# EAGLE design v01 (EAGLE 7.2.0)
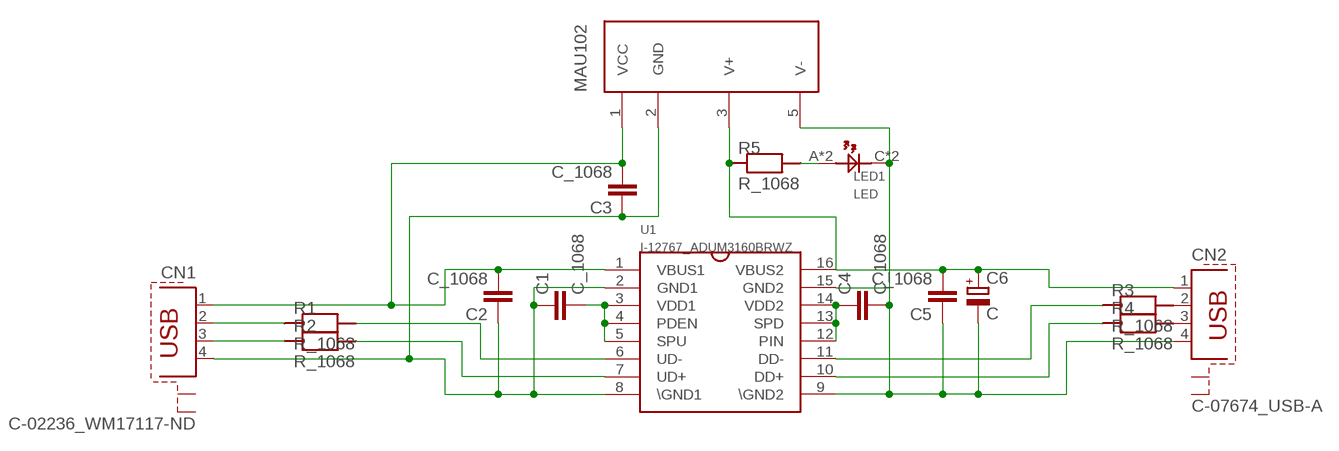
[diagram p0: schematic, sheet 1]

## Parts
C1  C_1068  [C0603]
C2  C_1068  [C0603]
C3  C_1068  [C0603]
C4  C_1068  [C0603]
C5  C_1068  [C0603]
C6  C  [153CLV-1012]
CN1  C-02236_WM17117-ND  [WM17117-ND]
CN2  C-07674_USB-A  [PN87520-S]
LED1  LED  [CHIPLED_0805]
MAU102  M-04131_MAU102  [MAU102]
R1  R_1068  [R0603]
R2  R_1068  [R0603]
R3  R_1068  [R0603]
R4  R_1068  [R0603]
R5  R_1068  [R0603]
U1  I-12767_ADUM3160BRWZ  [ADUM3160BRWZ]

## Nets
GNDA: C1.1 C1.D1 C2.1 C2.D1 C3.1 C3.D1 CN1.4 MAU102.2(GND) U1.2(GND1) U1.8(\GND1)
GNDB: C4.2 C4.D2 C5.1 C5.D1 C6.- C6.-1(-) C6.-2(-) CN2.4 LED1.C LED1.DC(C) MAU102.5(V-) U1.9(\GND2) U1.15(GND2)
N$3: C1.2 C1.D2 U1.3(VDD1) U1.4(PDEN) U1.5(SPU)
N$4: R1.2 R1.D2 U1.6(UD-)
N$5: R2.2 R2.D2 U1.7(UD+)
N$6: CN1.2 R1.1 R1.D1
N$7: CN1.3 R2.1 R2.D1
N$10: C4.1 C4.D1 U1.12(PIN) U1.13(SPD) U1.14(VDD2)
N$11: CN2.2 R3.2 R3.D2
N$12: CN2.3 R4.2 R4.D2
N$13: LED1.A LED1.DA(A) R5.2 R5.D2
N$14: R3.1 R3.D1 U1.11(DD-)
N$15: R4.1 R4.D1 U1.10(DD+)
VCCA: C2.2 C2.D2 C3.2 C3.D2 CN1.1 MAU102.1(VCC) U1.1(VBUS1)
VCCB: C5.2 C5.D2 C6.+ C6.+1(+) C6.+2(+) CN2.1 MAU102.3(V+) R5.1 R5.D1 U1.16(VBUS2)
Unconnected: CN1.P$1(S1) CN1.P$2(S2) CN1.SD1(S1) CN1.SD2(S2) CN2.S1 CN2.S2

## Library data of the parts
C1-C5 = USB-ISO:C_1068
C6 = USB-ISO:C
CN1 = USB-ISO:C-02236_WM17117-ND
CN2 = USB-ISO:C-07674_USB-A; OC_FARNELL: unknown; OC_NEWARK: unknown
LED1 = USB-ISO:LED
MAU102 = USB-ISO:M-04131_MAU102
R1-R5 = USB-ISO:R_1068
U1 = USB-ISO:I-12767_ADUM3160BRWZ

## Board
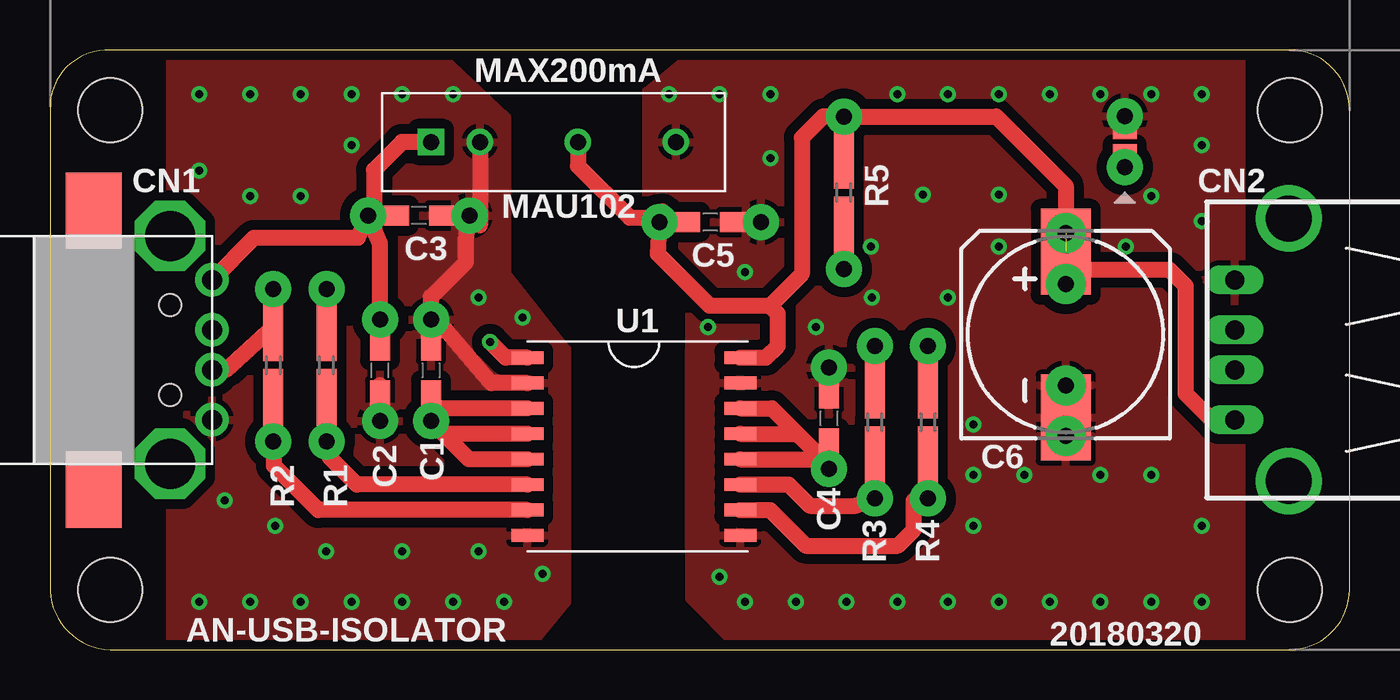
[diagram p1: board, top side]
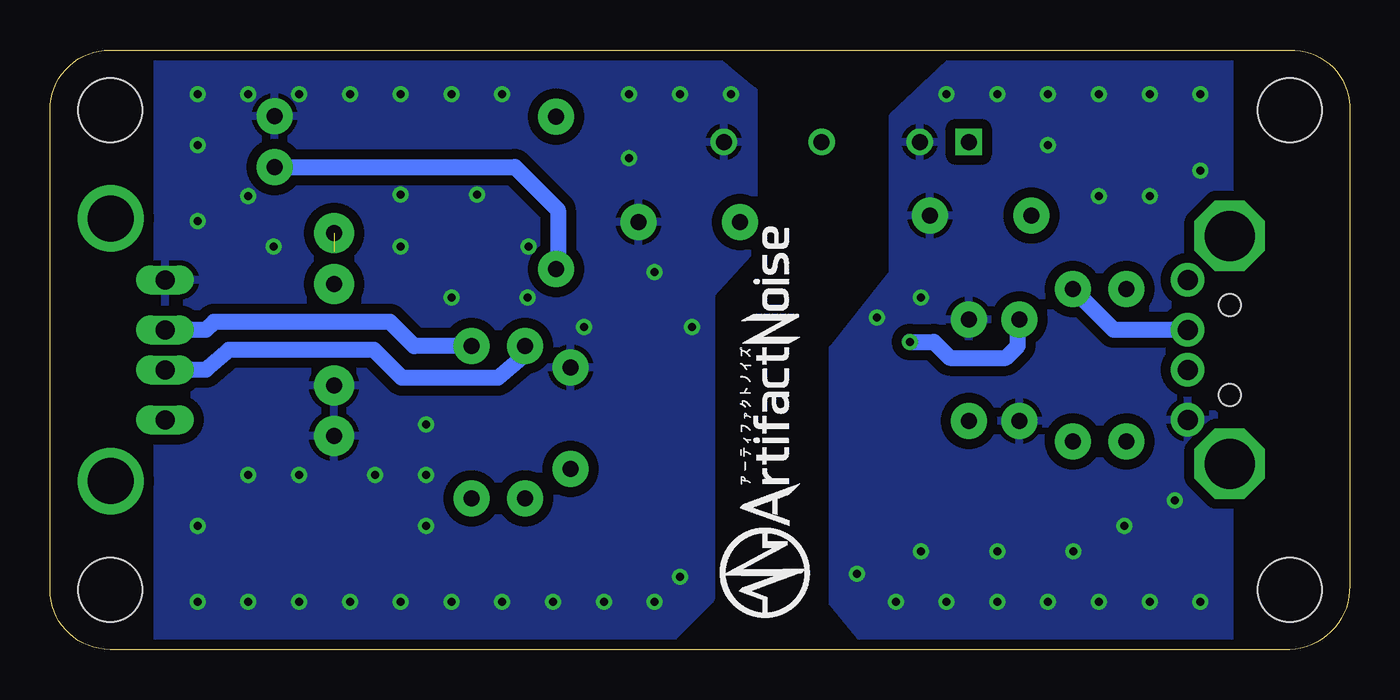
[diagram p2: board, bottom side, seen from below]

Size 65 x 30 mm. Coordinates in mm from the lower left corner, seen from the top.
Outline: 0,27.2 0,3.2 arc90 3,0 62,0 arc90 65,3 65,27 arc90 62,30 3,30 arc90 0,27.2
Copper layers (1*16): Top 0.035mm / dielectric 1.5mm / Bottom 0.035mm
Design rules "SeeedStudio_2layer_DRU_no_angle_20140221a": minimum track width 6mil, minimum drill 12mil, track to track 6mil, track to pad 6mil, pad to pad 6mil, via to via 6mil, smd to smd 0mil, copper to edge 10mil, drill to drill 10mil, minimum pad ring 10mil, minimum via ring 6mil, stop-mask expansion 2mil, vias tented up to drill 25mil, thermal gap 10mil
Holes 3.2 mm at 3,27 3,3 62,27 62,3

### Footprints (pad centres in the part's own frame; a part is rotated, then mirrored left to right if it is on the bottom)
C0603 = smd 2.6 x 1: 1 -1.8,0; 2 1.8,0 | drill 0.8 pad 1.8: D1 -2.54,0; D2 2.54,0
153CLV-1012 = smd 4.3 x 2.5: + 4.15,0; - -4.15,0 | drill 0.8 pad 2: +1 2.54,0; +2 5.08,0; -1 -5.08,0; -2 -2.54,0
WM17117-ND = drill 1 pad 1.676: 1 -3.5,2.1; 2 -1,2.1; 3 1,2.1; 4 3.5,2.1 | smd 3.81 x 2.794: P$1 -6.97,-3.81; P$2 7,-3.81 | drill 2.5 pad 3.5 octagon: SD1 -5.7,0; SD2 5.7,0 | hole 1.1: -2.25,0; 2.25,0
PN87520-S = drill 0.95 long: 1 -3.5,2.71; 2 -1,2.71; 3 1,2.71; 4 3.5,2.71 | drill 2.3 pad 2.9: S1 -6.57,0; S2 6.57,0
CHIPLED_0805 = smd 1.2 x 0.8: A 0,-1.8; C 0,-0.74 | drill 0.8 pad 1.8: DA 0,-2.54; DC 0,0
MAU102 = drill 0.8 square: 1 -7.62,0 | drill 0.8: 2 -5.17,0; 3 -0.27,0; 5 4.63,0
R0603 = smd 3.2 x 1: 1 -1.8,0; 2 1.8,0 | drill 0.8 pad 1.8: D1 -3.81,0; D2 3.81,0
ADUM3160BRWZ = smd 1.6 x 0.635: 1 -5.325,4.445; 2 -5.325,3.175; 3 -5.325,1.905; 4 -5.325,0.635; 5 -5.325,-0.635; 6 -5.325,-1.905; 7 -5.325,-3.175; 8 -5.325,-4.445; 9 5.325,-4.445; 10 5.325,-3.175; 11 5.325,-1.905; 12 5.325,-0.635; 13 5.325,0.635; 14 5.325,1.905; 15 5.325,3.175; 16 5.325,4.445

### Placement (x,y rotation side)
C1  19.05,13.97 270 top
C2  16.51,13.97 90 top
C3  18.45,21.72 180 top
C4  38.97,11.57 90 top
C5  33.02,21.39 180 top
C6  50.8,15.76 90 top
CN1  6,15 270 top
CN2  61.96,15 90 top
LED1  53.76,26.68 0 top
MAU102  26.67,25.4 0 top
R1  13.83,14.23 270 top
R2  11.17,14.23 270 top
R3  41.25,11.37 90 top
R4  43.91,11.37 90 top
R5  39.7,22.86 270 top
U1  29.21,10.16 0 top
U$2  [AN-LOGO2]  27,1.6 90 bottom

### Tracks (layer width: path | path; a pad name or v marks a point on that pad's centre or on a via)
GNDA  (via drill 0.4 pad 0.8)
  Top 0.6: C1.D1 C1.1
  Top 0.8: U1.2 22.07,13.34 19.8,16 19.22,16 C1.1 | C1.D1 19.05,17.65 20.8,19.4 20.8,20.53 C3.D1 21.5,21.23 MAU102.2 | C2.D1 16.51,13.23
  other vias: 7.46,2.38 10,2.38 12.54,2.38 15.08,2.38 17.62,2.38 20.16,2.38 22.7,2.38 24.64,3.78 8.73,7.46 11.27,6.19 13.81,4.92 17.62,4.92 21.43,4.92 7.46,27.78 10,27.78 12.54,27.78 15.08,27.78 17.62,27.78 20.16,27.78 7.46,23.97 10,22.7 12.54,22.7 15.08,25.24 21.43,17.62 23.63,16.62
  pour Top (isolate 0.5): 6,29.68 19.65,29.68 22.86,26.67 22.86,18.85 25.87,15.04 25.87,2.34 23.93,0 6,-0.2
  pour Bottom (isolate 0.5): 6,29.68 19.65,29.68 22.86,26.67 22.86,18.85 25.87,15.04 25.87,2.34 23.93,0 6,-0.2
GNDB  (via drill 0.4 pad 0.8)
  other vias: 34.76,18.89 30.95,27.78 33.49,27.78 36.03,27.78 57.62,27.78 55.08,27.78 52.54,27.78 50,27.78 47.46,27.78 44.92,27.78 42.38,27.78 36.04,24.58 57.62,25.24 55.08,22.7 41.07,20.17 33.49,3.65 34.76,2.38 37.3,2.38 39.84,2.38 42.38,2.38 44.92,2.38 47.46,2.38 50,2.38 52.54,2.38 55.08,2.38 57.62,2.38 57.62,6.19 55.08,8.73 52.54,8.73 48.73,8.73 46.19,8.73 46.19,6.19 46.19,11.27 38.3,16.15 41.11,17.62 44.92,17.62 47.46,20.16 47.46,22.77 43.65,22.77 53.81,20.16 57.62,21.43 32.9,16.15
  pour Top (isolate 0.5): 32.15,29.88 29.81,27.94 29.81,20.12 31.95,17.58 arc0 31.95,2.54 34.29,0.2 59.6,-0.2 59.6,29.68
  pour Bottom (isolate 0.5): 32.15,29.88 29.81,27.94 29.81,20.12 31.95,17.78 31.95,2.54 34.29,0.2 59.6,-0.2 59.6,29.68
N$3
  Top 0.8: U1.3 19.68,12.06 | 19.68,12.06 C1.D2 19.68,10.79 | U1.5 20.95,9.53 19.68,10.79 | U1.4 19.68,10.79 | 19.68,12.06 19.05,12.06 C1.2
N$4
  Top 0.8: U1.6 15.35,8.26 14,9.6 14,10.25 R1.D2 R1.2
N$5
  Top 0.8: U1.7 13.41,6.99 11.2,9.2 11.2,10.39 R2.D2 11.2,10.45 11.2,12.2 R2.2
N$6
  Top 0.8: R1.1 R1.D1
  Bottom 0.8: CN1.2 11.79,16 R1.D1
N$7
  Top 0.8: R2.1 R2.D1 11.2,17.47 11.2,16.2 8.8,14 CN1.3
N$10
  Top 0.8: 38.97,9.2 C4.1 | 38.97,9.2 C4.D1 38.48,9.53 U1.12 | U1.13 37.38,10.79 37.48,10.69 | 37.48,10.69 38.97,9.2 | 37.48,10.69 36.1,12.06 U1.14
N$11
  Top 0.8: R3.2 R3.D2
  Bottom 0.8: R3.D2 41.25,14.75 42.6,13.6 47.4,13.6 48.8,15 56.05,15 57.2,14 CN2.2
N$12
  Top 0.8: R4.2 R4.D2
  Bottom 0.8: R4.D2 46.78,15.18 48,16.4 56.8,16.4 57.2,16 CN2.3
N$13
  Top 0.8: R5.2 R5.D2
  Bottom 0.8: LED1.DA 41.74,24.14 39.6,22 39.6,19.55 R5.D2
N$14
  Top 0.8: R3.1 R3.D1 40.29,7.2 38,7.2 36.95,8.26 U1.11
N$15
  Top 0.8: R4.1 R4.D1 43.2,7.45 43.2,6 42.4,5.2 37.8,5.2 36.02,6.99 U1.10
VCCA  (via drill 0.4 pad 0.8)
  Top 0.8: U1.1 22.8,14.61 v22,15.4 | MAU102.1 17.6,25.4 16.2,24 16.2,21.01 C3.D2 | C3.D2 16.51,20.32 C2.D2 C2.2 | CN1.1 10.2,20.6 15.39,20.6 C3.D2 | C3.2 C3.D2
  Bottom 0.6: 16.6,16.42 C2.D2
  Bottom 0.8: v22,15.4 20.8,15.4 20,14.6 17.2,14.6 16.6,15.2 16.6,16.42 16.6,16.6 16.4,16.6
VCCB  (1 unrouted)
  Top 0.8: MAU102.3 26.4,24.2 29,21.6 30.47,21.6 30.48,21.59 C5.D2 | CN2.1 58.1,11.5 56.8,12.8 56.8,18.2 56,19 51.5,19 C6.+1 C6.+2 50.8,23.2 47.33,26.67 R5.D1 | 30.62,21.93 C5.D2 | C5.2 C5.D2 | U1.16 35.8,14.61 36.4,15.2 36.4,16.8 36,17.2 | 36,17.2 33,17.2 30.4,19.8 30.48,21.12 C5.D2 | R5.1 R5.D1 | R5.D1 38.67,26.67 37.6,25.6 37.6,18.8 36,17.2

### Text on the board
tPlace: MAX200mA | AN-USB-ISOLATOR | 20180320